# EasyEDA schematic SCH_Arduino-Programmer_2024-08-11.json
TITLE: Sheet_1; REV: 1.0; Date: 2024-08-10; Sheet: 1/1; Drawn By: ANSHUMANDOCX; Company: Your Company
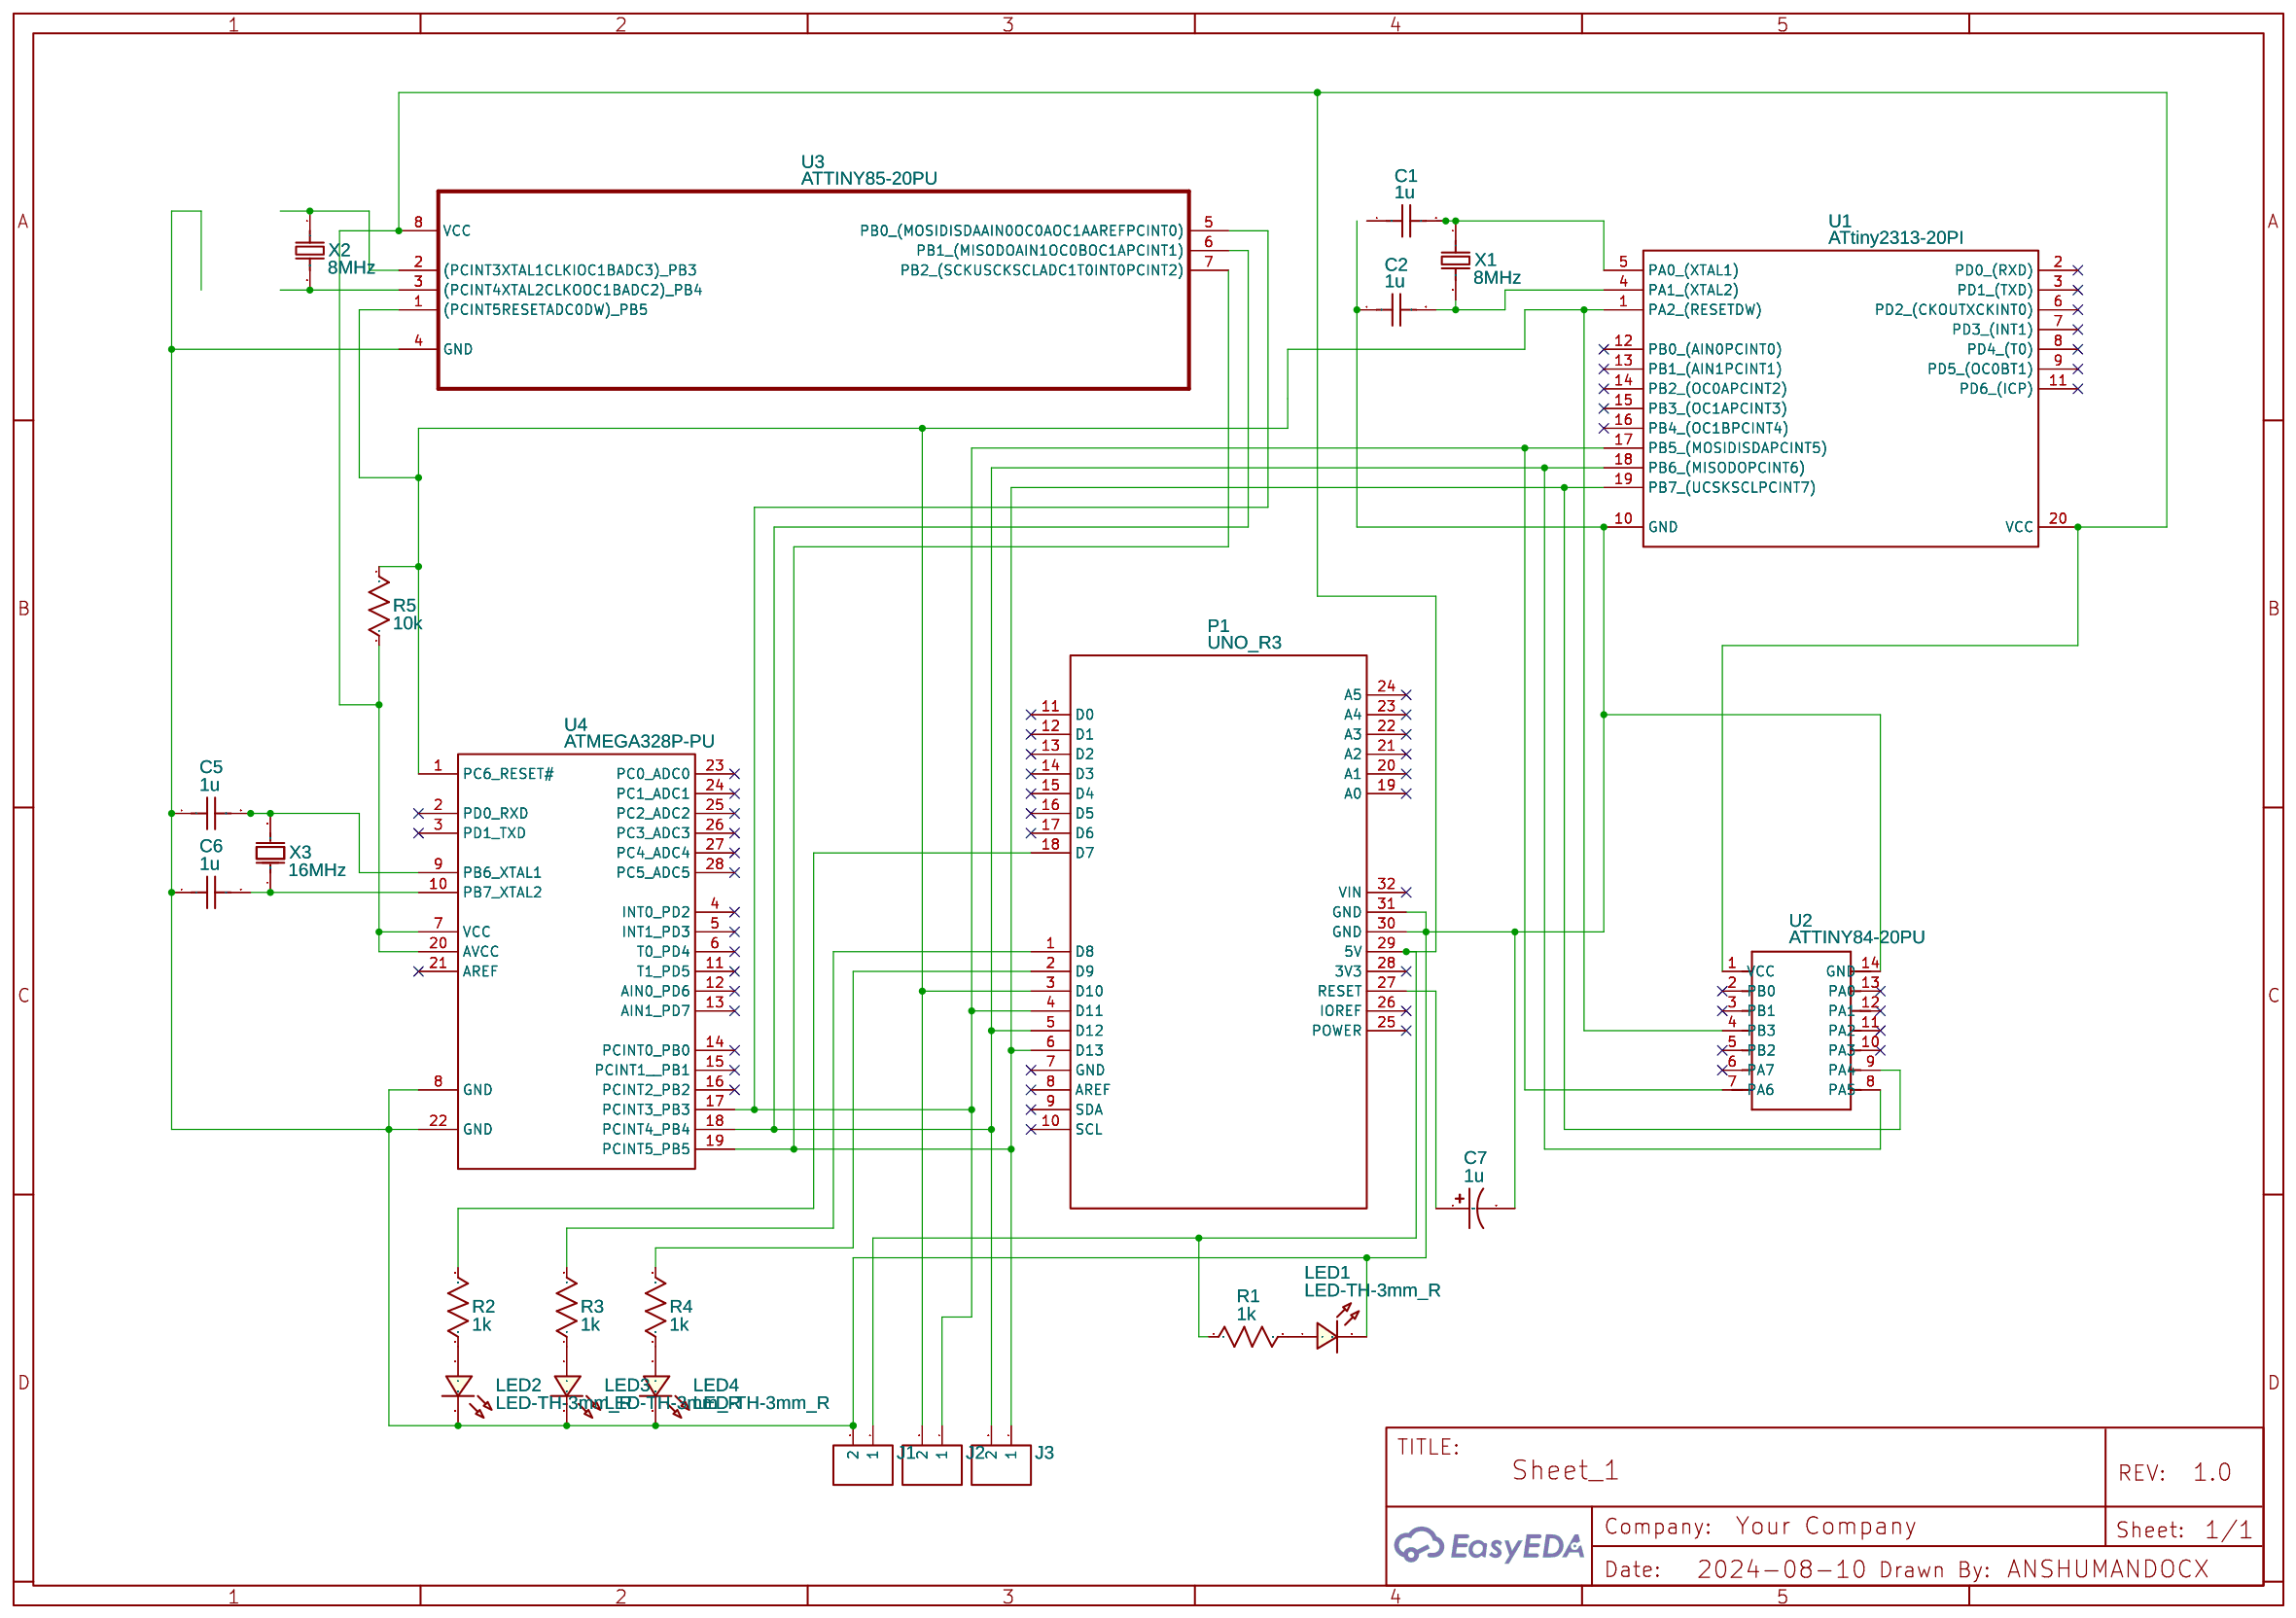
[diagram p0: schematic sheet]

## Parts
C1  1u  [RAD-0.1]
C2  1u  [RAD-0.1]
C5  1u  [RAD-0.1]
C6  1u  [RAD-0.1]
C7  1u  [CAP-D5.0×F2.0]
J1  HDR-M-2.54_1x2  [HDR-M-2.54_1X2]
J2  HDR-M-2.54_1x2  [HDR-M-2.54_1X2]
J3  HDR-M-2.54_1x2  [HDR-M-2.54_1X2]
LED1  LED-TH-3mm_R  [LED-TH_BD3.0_RED]
LED2  LED-TH-3mm_R  [LED-TH_BD3.0_RED]
LED3  LED-TH-3mm_R  [LED-TH_BD3.0_RED]
LED4  LED-TH-3mm_R  [LED-TH_BD3.0_RED]
P1  UNO_R3  [UNO_R3]
R1  1k  [R_AXIAL-0.4]
R2  1k  [R_AXIAL-0.4]
R3  1k  [R_AXIAL-0.4]
R4  1k  [R_AXIAL-0.4]
R5  10k  [R_AXIAL-0.4]
U1  ATtiny2313-20PI  [DIP20]
U2  ATTINY84-20PU  [DIP14-2.54-17.24X6.35MM]
U3  ATTINY85-20PU  [DIP254P762X533-8]
U4  ATMEGA328P-PU  [DIP-28_L34.6-W7.3-P2.54-LS10.2-BL]
X1  8MHz  [HC-49US_L11.5-W4.5-P4.88]
X2  8MHz  [HC-49US_L11.5-W4.5-P4.88]
X3  16MHz  [HC-49US_L11.5-W4.5-P4.88]

## Library data of the parts
C1 C2 C5 C6 = C_RAD-0.1_US: Contributor: LCEDA_Lib
C7 = CE_TH_D5.0×F2.0_US: Contributor: LCEDA_Lib
J1-J3 = HDR-M-2.54_1x2: Supplier Part: C124375; Supplier: LCSC; Contributor: LCEDA_Lib
LED1-LED4 = LED-TH-3mm_R: Manufacturer: EVERLIGHT(台湾亿光); Manufacturer Part: 204-10SDRD/S530-A3-L; Supplier Part: C84774; Supplier: LCSC; Contributor: LCEDA_Lib
P1 = UNO_R3: sourceId: 1T5FDZYC8
R1-R5 = R_AXIAL-0.4_US: Contributor: LCEDA_Lib
U1 = ATtiny2313-20PI: Low Power tinyAVR?8-Bit Microcontroller, 2K Flash Memory, 20MHz, Industrial Temperature, 20-Lead PDIP
U2 = ATTINY84-20PU: DIP IC MCU 8BIT 20MHz 8KB; sourceId: eqICTb5nh
U3 = ATTINY85-20PU: SMD IC MCU- 8Bit 8Kb ISP flash 4Mhz 1.8-5.5V
U4 = ATMEGA328P-PU: sourceId: Oic6oiASL; Contributor: LCSC; Supplier: LCSC; Manufacturer: MICROCHIP(美国微芯); Supplier Part: C33901; JLCPCB Part Class: Extended Part
X1 X2 = 9B0806LCSC-AHQ2S: Supplier: LCSC; Manufacturer: TXC(晶技); Manufacturer Part: 9B08000006; Supplier Part: C97198; JLCPCB Part Class: Extended Part
X3 = E49A16E00000DE10C0: Supplier: LCSC; Manufacturer: HOSONIC(鸿星); Supplier Part: C116089; JLCPCB Part Class: Extended Part

## Nets
Net-(C1-2): C1.2 U1.5(PA0 (XTAL1)) X1.1
Net-(C2-1): C2.1 C5.1 C6.1 C7.2 J1.2 LED1.2 LED2.2 LED3.2 LED4.2 P1.30(GND) P1.31(GND) U1.10(GND) U2.14(GND) U3.4(GND) U4.8(GND) U4.22(GND)
Net-(C2-2): C2.2 U1.4(PA1 (XTAL2)) X1.2
Net-(C5-2): C5.2 U4.9(PB6 XTAL1) X3.2(OSC2)
Net-(C6-2): C6.2 U4.10(PB7 XTAL2) X3.1(OSC1)
Net-(C7-1): C7.1 P1.27(RESET)
Net-(J1-1): J1.1 P1.29(5V) R1.1 R5.1 U1.20(VCC) U2.1(VCC) U3.8(VCC) U4.7(VCC) U4.20(AVCC)
Net-(J2-1): J2.1 P1.4(D11) U1.17(PB5 (MOSIDISDAPCINT5)) U2.7(PA6) U3.5(PB0_(MOSIDISDAAIN0OC0AOC1AAREFPCINT0)) U4.17(PCINT3 PB3)
Net-(J2-2): J2.2 P1.3(D10) R5.2 U1.1(PA2 (RESETDW)) U2.4(PB3) U3.1((PCINT5RESETADC0DW)_PB5) U4.1(PC6 RESET#)
Net-(J3-1): J3.1 P1.6(D13) U1.19(PB7 (UCSKSCLPCINT7)) U2.9(PA4) U3.7(PB2_(SCKUSCKSCLADC1T0INT0PCINT2)) U4.19(PCINT5 PB5)
Net-(J3-2): J3.2 P1.5(D12) U1.18(PB6 (MISODOPCINT6)) U2.8(PA5) U3.6(PB1_(MISODOAIN1OC0BOC1APCINT1)) U4.18(PCINT4 PB4)
Net-(LED1-1): LED1.1 R1.2
Net-(LED2-1): LED2.1 R2.1
Net-(LED3-1): LED3.1 R3.1
Net-(LED4-1): LED4.1 R4.1
Net-(P1-1): P1.1(D8) R3.2
Net-(P1-2): P1.2(D9) R4.2
Net-(P1-18): P1.18(D7) R2.2
Net-(U3-2): U3.2((PCINT3XTAL1CLKIOC1BADC3)_PB3) X2.1
Net-(U3-3): U3.3((PCINT4XTAL2CLKOOC1BADC2)_PB4) X2.2

Not connected (* = marked no-connect by the designer): C1 1; P1 7(GND)* 8(AREF)* 9(SDA)* 10(SCL)* 11(D0)* 12(D1)* 13(D2)* 14(D3)* 15(D4)* 16(D5)* 17(D6)* 19(A0)* 20(A1)* 21(A2)* 22(A3)* 23(A4)* 24(A5)* 25(POWER)* 26(IOREF)* 28(3V3)* 32(VIN)*; U1 2(PD0 (RXD))* 3(PD1 (TXD))* 6(PD2 (CKOUTXCKINT0))* 7(PD3 (INT1))* 8(PD4 (T0))* 9(PD5 (OC0BT1))* 11(PD6 (ICP))* 12(PB0 (AIN0PCINT0))* 13(PB1 (AIN1PCINT1))* 14(PB2 (OC0APCINT2))* 15(PB3 (OC1APCINT3))* 16(PB4 (OC1BPCINT4))*; U2 2(PB0)* 3(PB1)* 5(PB2)* 6(PA7)* 10(PA3)* 11(PA2)* 12(PA1)* 13(PA0)*; U4 2(PD0 RXD)* 3(PD1 TXD)* 4(INT0 PD2)* 5(INT1 PD3)* 6(T0 PD4)* 11(T1 PD5)* 12(AIN0 PD6)* 13(AIN1 PD7)* 14(PCINT0 PB0)* 15(PCINT1  PB1)* 16(PCINT2 PB2)* 21(AREF)* 23(PC0 ADC0)* 24(PC1 ADC1)* 25(PC2 ADC2)* 26(PC3 ADC3)* 27(PC4 ADC4)* 28(PC5 ADC5)*
